# EAGLE schematic bms1818 (EAGLE 9.6.2)
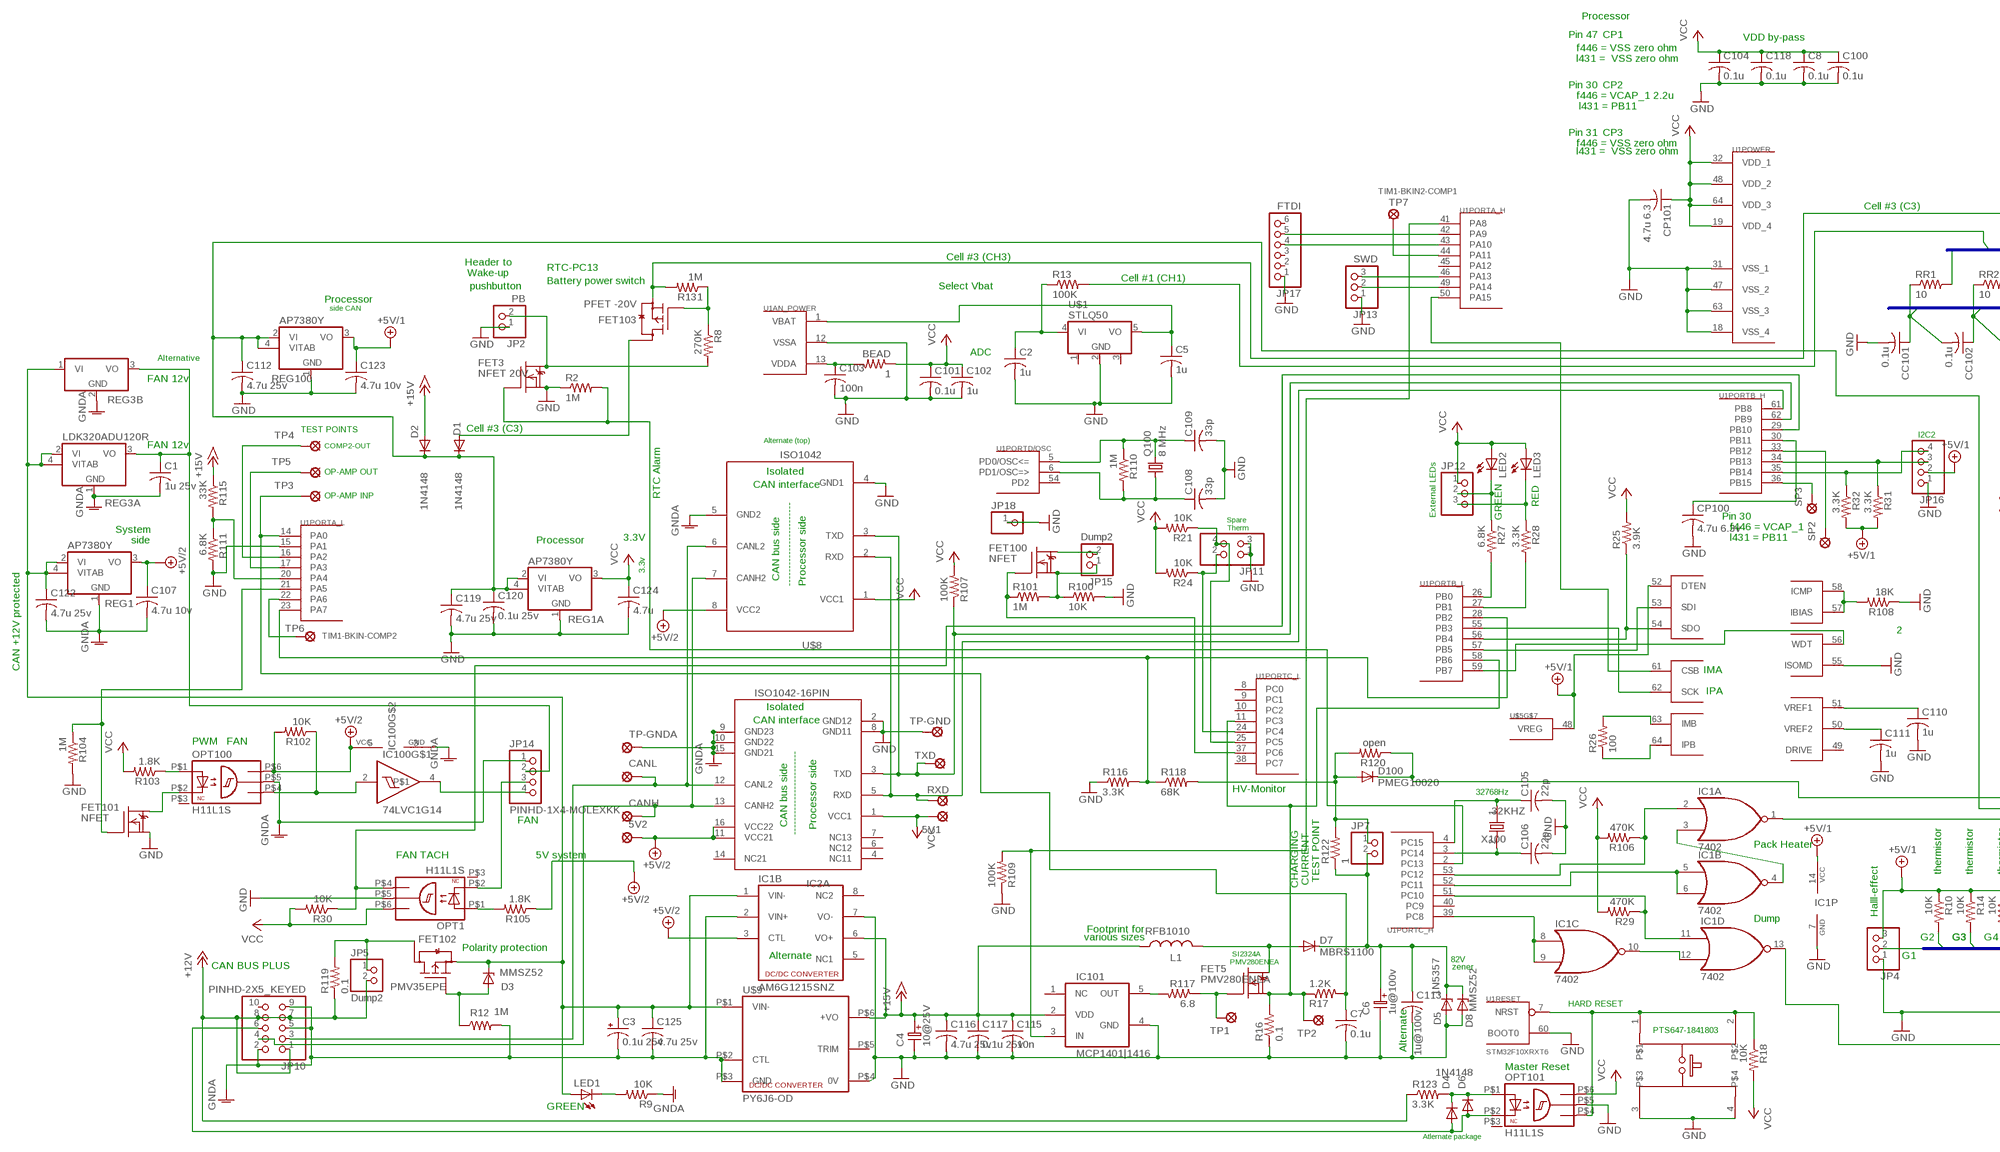
[diagram p0: schematic, sheet 1, part 1 of 2]
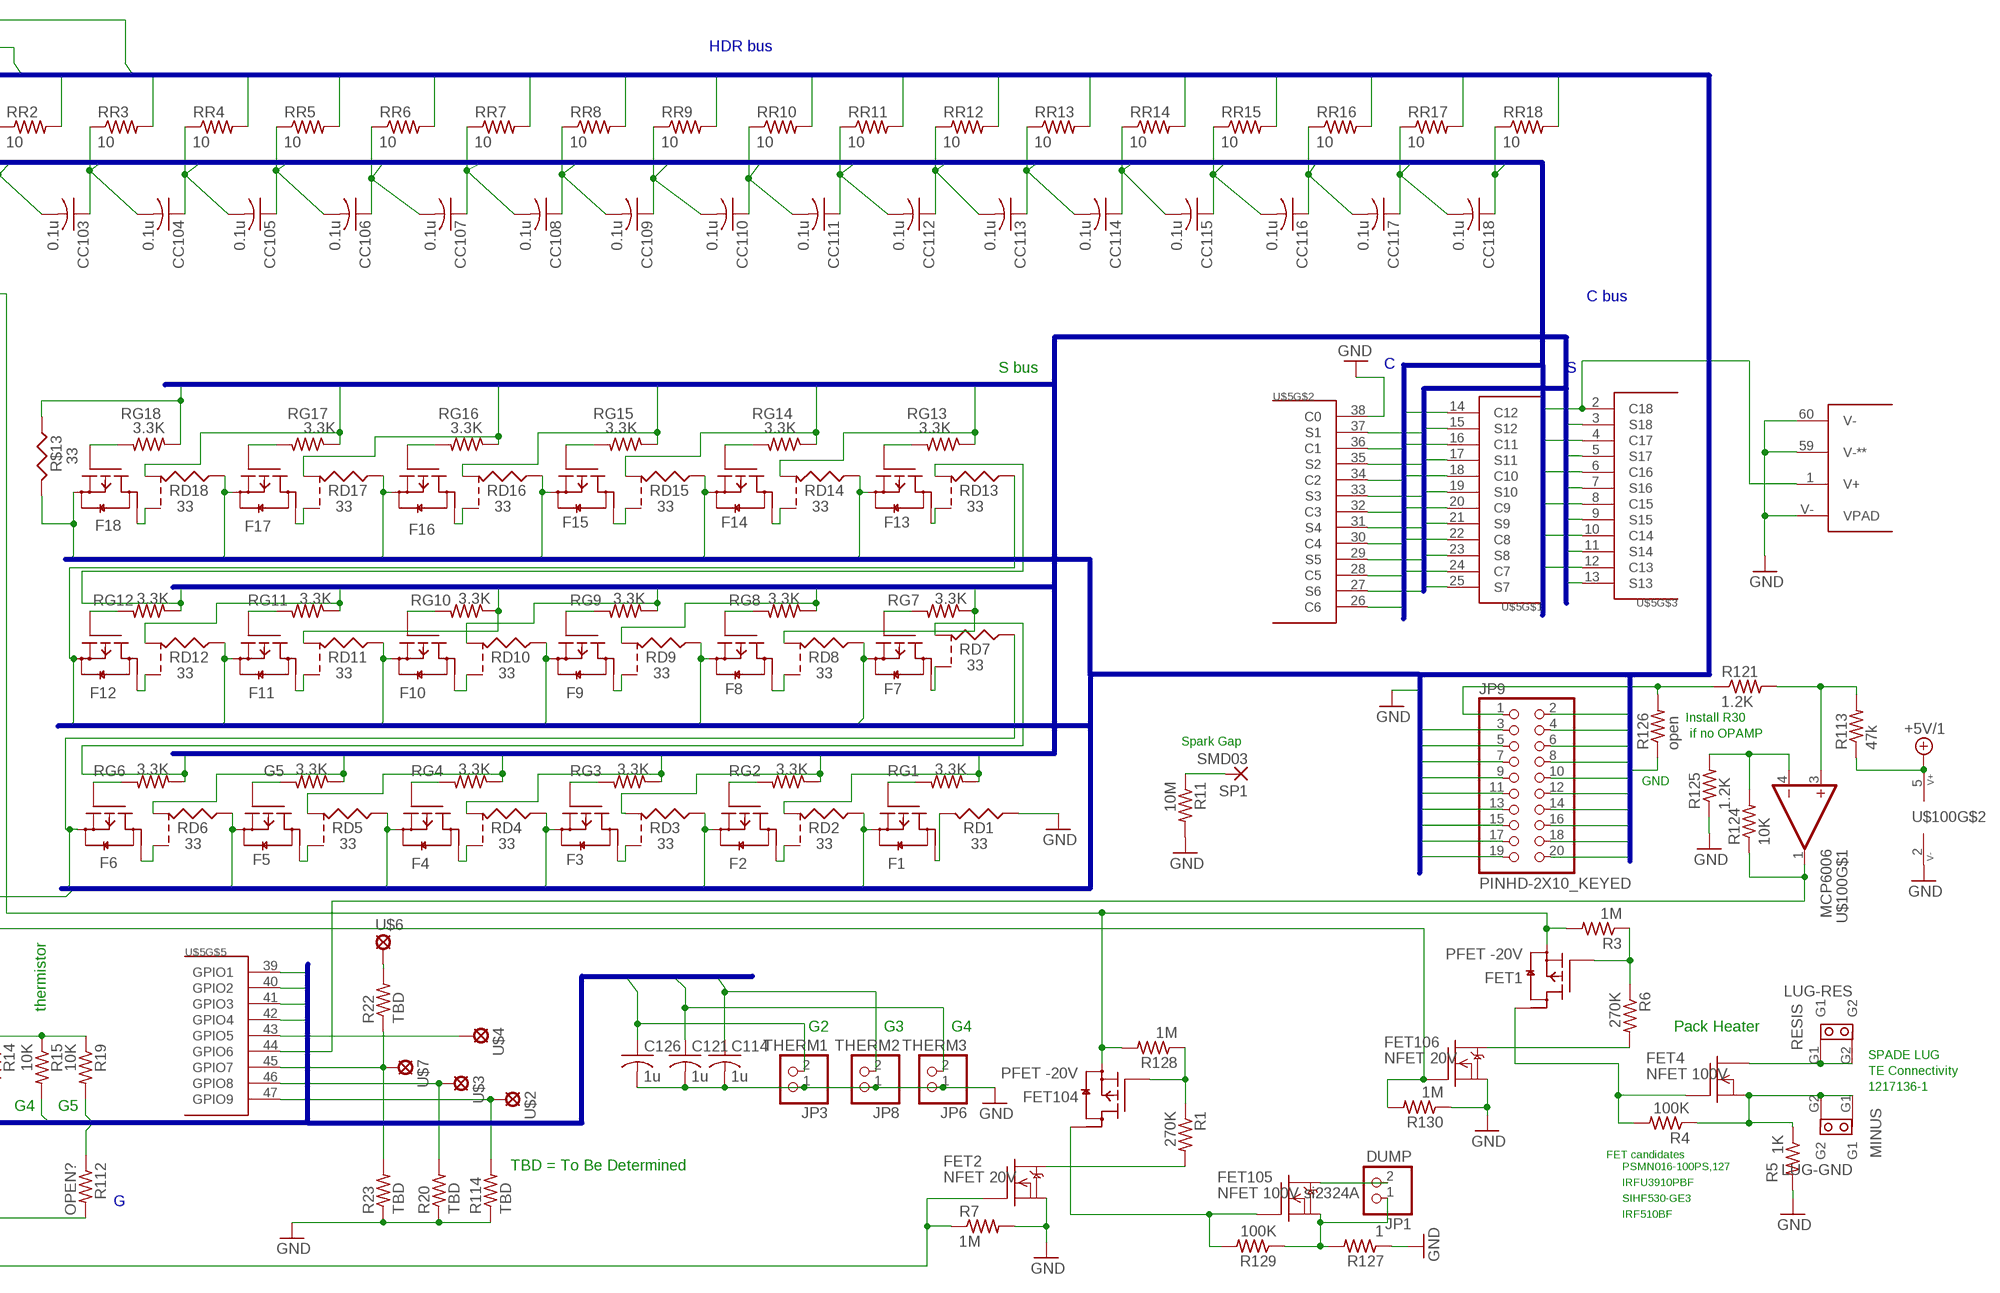
[diagram p1: schematic, sheet 1, part 2 of 2]

## Parts
5V1  SOLDPAD028  [SOLPAD028]
5V2  SOLDPAD028  [SOLPAD028]
32KHZ  X100  XTAL32KX32  [32KHZ]
BEAD  1  R-US_R0603  [R0603]
C1  1u 25v  C-USC0603  [C0603]
C2  1u  C-USC0603  [C0603]
C3  0.1u 25v  CPOL-USE5-8.5  [E5-8,5]
C4  10@25V  ELC-2,5L  [ES-2,5L]
C5  1u  C-USC0603  [C0603]
C6  1u@100v  ELC-2,5L  [ES-2,5L]
C7  0.1u  C-USC0603  [C0603]
C8  0.1u  C-USC0603  [C0603]
C100  0.1u  C-USC0603  [C0603]
C101  0.1u  C-USC0603  [C0603]
C102  1u  C-USC0603  [C0603]
C103  100n  C-USC0603  [C0603]
C104  0.1u  C-USC0603  [C0603]
C105  22p  C-USC0603  [C0603]
C106  22p  C-USC0603  [C0603]
C107  4.7u 10v  C-USC0603  [C0603]
C108  33p  C-USC0603  [C0603]
C109  33p  C-USC0603  [C0603]
C110  1u  C-USC0603  [C0603]
C111  1u  C-USC0603  [C0603]
C112  4.7u 25v  C-USC0805  [C0805]
C113  1u@100v  C-USC1206  [C1206]
C114  1u  C-USC0603  [C0603]
C115  10n  C-USC0603  [C0603]
C116  4.7u 25v  C-USC0805  [C0805]
C117  0.1u 25v  C-USC0603  [C0603]
C118  0.1u  C-USC0603  [C0603]
C119  4.7u 25v  C-USC0805  [C0805]
C120  0.1u 25v  C-USC0603  [C0603]
C121  1u  C-USC0603  [C0603]
C122  4.7u 25v  C-USC0805  [C0805]
C123  4.7u 10v  C-USC0603  [C0603]
C124  4.7u  C-USC0603  [C0603]
C125  4.7u 25v  C-USC0805  [C0805]
C126  1u  C-USC0603  [C0603]
CANH  SOLDPAD028  [SOLPAD028]
CANL  SOLDPAD028  [SOLPAD028]
CC101  0.1u  C-USC0603  [C0603]
CC102  0.1u  C-USC0603  [C0603]
CC103  0.1u  C-USC0603  [C0603]
CC104  0.1u  C-USC0603  [C0603]
CC105  0.1u  C-USC0603  [C0603]
CC106  0.1u  C-USC0603  [C0603]
CC107  0.1u  C-USC0603  [C0603]
CC108  0.1u  C-USC0603  [C0603]
CC109  0.1u  C-USC0603  [C0603]
CC110  0.1u  C-USC0603  [C0603]
CC111  0.1u  C-USC0603  [C0603]
CC112  0.1u  C-USC0603  [C0603]
CC113  0.1u  C-USC0603  [C0603]
CC114  0.1u  C-USC0603  [C0603]
CC115  0.1u  C-USC0603  [C0603]
CC116  0.1u  C-USC0603  [C0603]
CC117  0.1u  C-USC0603  [C0603]
CC118  0.1u  C-USC0603  [C0603]
CP100  4.7u 6.3v  C-USC0603  [C0603]
CP101  4.7u 6.3  C-USC0603  [C0603]
D1  1N4148  1N4004_VERT  [DO41-10_VERT]
D2  1N4148  1N4004_VERT  [DO41-10_VERT]
D3  MMSZ52  ZENER-DIODESOD80C  [SOD80C]
D4  DIODE-SOD323-R  [SOD323-R]
D5  1N5357  ZENER-5W-VERT  [ZENER-VERT]
D6  1N4148  DIODE-SOD123  [SOD123]
D7  MBRS1100  B100LB  [SMB_1]
D8  MMSZ52  ZENER-DIODESOD80C  [SOD80C]
D100  PMEG10020  PMEG10020PMEG10020-123W  [SOD123W]
F1  FET-P-SOT23  [SOT-23]
F2  FET-P-SOT23  [SOT-23]
F3  FET-P-SOT23  [SOT-23]
F4  FET-P-SOT23  [SOT-23]
F5  FET-P-SOT23  [SOT-23]
F6  FET-P-SOT23  [SOT-23]
F7  FET-P-SOT23  [SOT-23]
F8  FET-P-SOT23  [SOT-23]
F9  FET-P-SOT23  [SOT-23]
F10  FET-P-SOT23  [SOT-23]
F11  FET-P-SOT23  [SOT-23]
F12  FET-P-SOT23  [SOT-23]
F13  FET-P-SOT23  [SOT-23]
F14  FET-P-SOT23  [SOT-23]
F15  FET-P-SOT23  [SOT-23]
F16  FET-P-SOT23  [SOT-23]
F17  FET-P-SOT23  [SOT-23]
F18  FET-P-SOT23  [SOT-23]
FET1  PFET -20V  FET-P-SOT23  [SOT-23]
FET2  NFET 20V  DMN3404L  [SOT-23]
FET3  NFET 20V  DMN3404L  [SOT-23]
FET4  NFET 100V  RFP30N06  [TO220V]
FET5  PMV280ENEA  DMN3404L  [SOT-23]
FET100  NFET  DMN3404L  [SOT-23]
FET101  NFET  DMN3404L  [SOT-23]
FET102  PMV35EPE  FET-P-SOT23  [SOT-23]
FET103  PFET -20V  FET-P-SOT23  [SOT-23]
FET104  PFET -20V  FET-P-SOT23  [SOT-23]
FET105  NFET 100V si2324A  DMN3404L  [SOT-23]
FET106  NFET 20V  DMN3404L  [SOT-23]
G5  3.3K  R-US_R0603  [R0603]
IC1  7402  [TSSOP14]
IC1B  AM6G1215SNZ  [DCDC7PINB]
IC2A  ISO1042-16PIN  [SO-16DW]
IC100  74LVC1G14  74LVC1G17  [SOT-23]
IC101  MCP1401|1416  MCP1416  [SOT23-5]
JP1  DUMP  PINHD-1X2  [1X02]
JP2  PB  PINHD-1X2  [1X02]
JP3  THERM1  PINHD-1X2  [1X02]
JP4  PINHD-1X3  [1X03]
JP5  Dump2  PINHD-1X2  [1X02]
JP6  THERM3  PINHD-1X2  [1X02]
JP7  PINHD-1X2  [1X02]
JP8  THERM2  PINHD-1X2  [1X02]
JP9  PINHD-2X10_KEYED  [2X10_KEYED]
JP10  PINHD-2X5_KEYED  [2X05_KEYED]
JP11  PINHD-2X2  [2X02]
JP12  PINHD-1X3  [1X03]
JP13  SWD  PINHD-1X3  [1X03]
JP14  PINHD-1X4-MOLEXKK  [1X4-MOLEXKK]
JP15  Dump2  PINHD-1X2  [1X02]
JP16  PINHD-1X4  [1X04]
JP17  FTDI  PINHD-1X6  [1X06]
JP18  PINHD-1X1  [1X01]
L1  RFB1010  [INDUCTOR6.0]
LED1  LEDCHIP-LED0603  [CHIP-LED0603]
LED2  LEDCHIP-LED0603  [CHIP-LED0603]
LED3  LEDCHIP-LED0603  [CHIP-LED0603]
LUG-GND  MINUS  SPADE-TAB  [SPADE_TAB]
LUG-RES  RESIS  SPADE-TAB  [SPADE_TAB]
OPT1  H11L1S  H!!LX  [SMD-6]
OPT100  H11L1S  H!!LX  [SMD-6]
OPT101  H11L1S  H!!LX  [SMD-6]
Q100  8 MHz  CRYTALHC49S  [HC49/S]
R1  270K  R-US_R0603  [R0603]
R2  1M  R-US_R0603  [R0603]
R3  1M  R-US_R0603  [R0603]
R4  100K  R-US_R0603  [R0603]
R5  1K  R-US_R0603  [R0603]
R6  270K  R-US_R0603  [R0603]
R7  1M  R-US_R0603  [R0603]
R8  270K  R-US_R0603  [R0603]
R9  10K  R-US_R0603  [R0603]
R10  10K  R-US_R0603  [R0603]
R11  10M  R-US_R0603  [R0603]
R12  1M  R-US_R0603  [R0603]
R13  100K  R-US_R0603  [R0603]
R14  10K  R-US_R0603  [R0603]
R15  10K  R-US_R0603  [R0603]
R16  0.1  R-US_M1206  [M1206]
R17  1.2K  R-US_R0603  [R0603]
R18  10K  R-US_R0603  [R0603]
R19  10K  R-US_R0603  [R0603]
R20  TBD  R-US_R0603  [R0603]
R21  10K  R-US_R0603  [R0603]
R22  TBD  R-US_R0603  [R0603]
R23  TBD  R-US_R0603  [R0603]
R24  10K  R-US_R0603  [R0603]
R25  3.9K  R-US_R0603  [R0603]
R26  100  R-US_R0603  [R0603]
R27  6.8K  R-US_R0603  [R0603]
R28  3.3K  R-US_R0603  [R0603]
R29  470K  R-US_R0603  [R0603]
R30  10K  R-US_R0603  [R0603]
R31  3.3K  R-US_R0603  [R0603]
R32  3.3K  R-US_R0603  [R0603]
R100  10K  R-US_R0603  [R0603]
R101  1M  R-US_R0603  [R0603]
R102  10K  R-US_R0603  [R0603]
R103  1.8K  R-US_R0603  [R0603]
R104  1M  R-US_R0603  [R0603]
R105  1.8K  R-US_R0603  [R0603]
R106  470K  R-US_R0603  [R0603]
R107  100K  R-US_R0603  [R0603]
R108  18K  R-US_R0603  [R0603]
R109  100K  R-US_R0603  [R0603]
R110  1M  R-US_R0603  [R0603]
R111  6.8K  R-US_R0603  [R0603]
R112  OPEN?  R-US_R0603  [R0603]
R113  47k  R-US_R0603  [R0603]
R114  TBD  R-US_R0603  [R0603]
R115  33K  R-US_R0603  [R0603]
R116  3.3K  R-US_R0603  [R0603]
R117  6.8  R-US_R0603  [R0603]
R118  68K  R-US_R0603  [R0603]
R119  0.1  R-US_R0805  [R0805]
R120  open  R-US_R0603  [R0603]
R121  1.2K  R-US_R0603  [R0603]
R122  1  R-US_R0603  [R0603]
R123  3.3K  R-US_R0603  [R0603]
R124  10K  R-US_R0603  [R0603]
R125  1.2K  R-US_R0603  [R0603]
R126  open  R-US_R0603  [R0603]
R127  1  R-US_R0603  [R0603]
R128  1M  R-US_R0603  [R0603]
R129  100K  R-US_R0603  [R0603]
R130  1M  R-US_R0603  [R0603]
R131  1M  R-US_R0603  [R0603]
R$13  33  RESUS-S2,5  [RS-2,5]
RD1  33  RESUS-S2,5  [RS-2,5]
RD2  33  RESUS-S2,5-2  [RS-2,5-2]
RD3  33  RESUS-S2,5-2  [RS-2,5-2]
RD4  33  RESUS-S2,5-2  [RS-2,5-2]
RD5  33  RESUS-S2,5-2  [RS-2,5-2]
RD6  33  RESUS-S2,5-2  [RS-2,5-2]
RD7  33  RESUS-S2,5-2  [RS-2,5-2]
RD8  33  RESUS-S2,5-2  [RS-2,5-2]
RD9  33  RESUS-S2,5-2  [RS-2,5-2]
RD10  33  RESUS-S2,5-2  [RS-2,5-2]
RD11  33  RESUS-S2,5-2  [RS-2,5-2]
RD12  33  RESUS-S2,5-2  [RS-2,5-2]
RD13  33  RESUS-S2,5-2  [RS-2,5-2]
RD14  33  RESUS-S2,5-2  [RS-2,5-2]
RD15  33  RESUS-S2,5-2  [RS-2,5-2]
RD16  33  RESUS-S2,5-2  [RS-2,5-2]
RD17  33  RESUS-S2,5-2  [RS-2,5-2]
RD18  33  RESUS-S2,5-2  [RS-2,5-2]
REG1  AP7380Y  [SOT89]
REG1A  AP7380Y  [SOT89]
REG3A  LDK320ADU120R  AP7380Y  [SOT89]
REG3B  LM7812T  78  [TO220V]
REG100  AP7380Y  [SOT89]
RESET  RESET  E-SWITCH2  [E-SWITCH2]
RG1  3.3K  R-US_R0603  [R0603]
RG2  3.3K  R-US_R0603  [R0603]
RG3  3.3K  R-US_R0603  [R0603]
RG4  3.3K  R-US_R0603  [R0603]
RG6  3.3K  R-US_R0603  [R0603]
RG7  3.3K  R-US_R0603  [R0603]
RG8  3.3K  R-US_R0603  [R0603]
RG9  3.3K  R-US_R0603  [R0603]
RG10  3.3K  R-US_R0603  [R0603]
RG11  3.3K  R-US_R0603  [R0603]
RG12  3.3K  R-US_R0603  [R0603]
RG13  3.3K  R-US_R0603  [R0603]
RG14  3.3K  R-US_R0603  [R0603]
RG15  3.3K  R-US_R0603  [R0603]
RG16  3.3K  R-US_R0603  [R0603]
RG17  3.3K  R-US_R0603  [R0603]
RG18  3.3K  R-US_R0603  [R0603]
RR1  10  R-US_R0603  [R0603]
RR2  10  R-US_R0603  [R0603]
RR3  10  R-US_R0603  [R0603]
RR4  10  R-US_R0603  [R0603]
RR5  10  R-US_R0603  [R0603]
RR6  10  R-US_R0603  [R0603]
RR7  10  R-US_R0603  [R0603]
RR8  10  R-US_R0603  [R0603]
RR9  10  R-US_R0603  [R0603]
RR10  10  R-US_R0603  [R0603]
RR11  10  R-US_R0603  [R0603]
RR12  10  R-US_R0603  [R0603]
RR13  10  R-US_R0603  [R0603]
RR14  10  R-US_R0603  [R0603]
RR15  10  R-US_R0603  [R0603]
RR16  10  R-US_R0603  [R0603]
RR17  10  R-US_R0603  [R0603]
RR18  10  R-US_R0603  [R0603]
RXD  SOLDPAD028  [SOLPAD028]
SP1  SMD03  [SMD03]
SP2  SOLDPAD028  [SOLPAD028]
SP3  SOLDPAD028  [SOLPAD028]
TP1  SOLDPAD028  [SOLPAD028]
TP2  SOLDPAD028  [SOLPAD028]
TP3  SOLDPAD0.6MM  [SOLPAD.6MM]
TP4  SOLDPAD0.6MM  [SOLPAD.6MM]
TP5  SOLDPAD0.6MM  [SOLPAD.6MM]
TP6  SOLDPAD0.6MM  [SOLPAD.6MM]
TP7  SOLDPAD0.6MM  [SOLPAD.6MM]
TP-GND  SOLDPAD028  [SOLPAD028]
TP-GNDA  SOLDPAD028  [SOLPAD028]
TXD  SOLDPAD028  [SOLPAD028]
U1  STM32F10XRXT6  [TQFP64]
U$1  STLQ50  [SOT-323-5]
U$2  SOLDPAD028  [SOLPAD028]
U$3  SOLDPAD028  [SOLPAD028]
U$4  SOLDPAD028  [SOLPAD028]
U$5  LTC6813  [TQFP64_PAD]
U$6  SOLDPAD028  [SOLPAD028]
U$7  SOLDPAD028  [SOLPAD028]
U$8  ISO1042  [SOIC-8]
U$9  PY6J6-OD  [PYJ6-OD]
U$100  MCP6006  [SC-70-5]

## Nets
12V-R: FET102.3(D) JP5.1 R119.2
+5V/1: C123.1 IC1.14(P:VCC) JP4.3 JP16.2 R10.1 R14.1 R15.1 R19.1 R31.2 R32.2 R113.1 REG100.3(VO) U$5.48(VREG) U$5.52(DTEN) U$100.5(V+)
+5V/2: 5V2.MP C107.1 IC1B.3(CTL) IC2A.11(VCC21) IC2A.16(VCC22) IC100.5(VCC) OPT100.P$6(VCC) R102.2 R105.1 REG1.3(VO) U$8.8(VCC2)
+12V: JP5.2 JP10.1 JP10.7 JP10.8 R119.1 R123.1
+15V: C4.1 C115.1 C116.1 C117.1 D2.A IC1B.6(VO+) IC101.2(VDD) L1.1 R115.1 U$9.P$6(+VO)
/PC10: IC1.3(A:I1) IC1.4(B:O)
BATSW-NDRAIN: FET3.3(D) JP2.2 R8.2
BATSW-NDRAIN1: FET2.3(D) R1.2
BATSW-NDRAIN2: FET106.3(D) R6.2
BATSW-PGATE: FET103.1(G) R8.1 R131.1
BATSW-PGATE1: FET104.1(G) R1.1 R128.1
BATSW-PGATE2: FET1.1(G) R3.1 R6.1
BIGFET-DRAIN: FET4.2(D) LUG-RES.G1 LUG-RES.G2
BIGFET-GATE: FET1.3(D) FET4.1(G) R4.2
BIGFET-SOURCE: FET4.3(S) LUG-GND.G1 LUG-GND.G2 R4.1 R5.1
C1: CC101.1 CC102.2 RR1.1 U$5.36(C1)
C2: CC102.1 CC103.2 RR2.1 U$5.34(C2)
C3: CC103.1 CC104.2 RR3.1 U$5.32(C3)
C4: CC104.1 CC105.2 RR4.1 U$5.30(C4)
C5: CC105.1 CC106.2 RR5.1 U$5.28(C5)
C6: CC106.1 CC107.2 RR6.1 U$5.26(C6)
C7: CC107.1 CC108.2 RR7.1 U$5.24(C7)
C8: CC108.1 CC109.2 RR8.1 U$5.22(C8)
C9: CC109.1 CC110.2 RR9.1 U$5.20(C9)
C10: CC110.1 CC111.2 RR10.1 U$5.18(C10)
C11: CC111.1 CC112.2 RR11.1 U$5.16(C11)
C12: CC112.1 CC113.2 RR12.1 U$5.14(C12)
C13: CC113.1 CC114.2 RR13.1 U$5.12(C13)
C14: CC114.1 CC115.2 RR14.1 U$5.10(C14)
C15: CC115.1 CC116.2 RR15.1 U$5.8(C15)
C16: CC116.1 CC117.2 RR16.1 U$5.6(C16)
C17: CC117.1 CC118.2 RR17.1 U$5.4(C17)
C18: CC118.1 RR18.1 U$5.1(V+) U$5.2(C18)
CAN+12PRO: C3.+ C122.1 C125.1 D3.C FET102.2(S) IC1B.1(VIN-) LED1.A REG1.2(VI) REG1.4(VITAB) REG3A.2(VI) REG3A.4(VITAB) REG3B.1(VI) U$9.P$1(VIN-)
CANH2: CANH.MP IC2A.13(CANH2) JP10.4 U$8.7(CANH2)
CANL2: CANL.MP IC2A.12(CANL2) JP10.3 U$8.6(CANL2)
CELL1-PFET-DRAIN: D1.A FET103.3(D)
CH1: F1.2(S) JP9.12 R13.2 RD2.1 RR1.2
CH2: F2.2(S) JP9.3 RD3.1 RR2.2
CH3: F3.2(S) FET103.2(S) JP9.13 R131.2 RD4.1 RR3.2
CH4: F4.2(S) JP9.4 RD5.1 RR4.2
CH5: F5.2(S) JP9.14 RD6.1 RR5.2
CH6: F6.2(S) JP9.5 RD7.1 RR6.2
CH7: F7.2(S) JP9.15 RD8.1 RR7.2
CH8: F8.2(S) JP9.6 RD9.1 RR8.2
CH9: F9.2(S) JP9.16 RD10.1 RR9.2
CH10: F10.2(S) JP9.7 RD11.1 RR10.2
CH11: F11.2(S) JP9.17 RD12.1 RR11.2
CH12: F12.2(S) JP9.8 RD13.1 RR12.2
CH13: F13.2(S) JP9.18 RD14.1 RR13.2
CH14: F14.2(S) JP9.9 RD15.1 RR14.2
CH15: F15.2(S) JP9.19 RD16.1 RR15.2
CH16: F16.2(S) JP9.10 RD17.1 RR16.2
CH17: F17.2(S) JP9.20 RD18.1 RR17.2
CH18: D100.A(C) F18.2(S) JP9.11 R120.1 R$13.2 RR18.2
CHGR-FET-DRAIN: D7.A FET5.3(D) L1.2
CHGR-TEST-V+: D100.C(A) JP7.1 R118.2 R120.2 R122.2
CHGR-V+: C6.1 C113.1 D5.2(C) D7.C D8.C JP7.2 R122.1
DRAIN$1: F1.3(D) RD1.2
DRAIN$2: F2.3(D) RD2.3
DRAIN$3: F3.3(D) RD3.3
DRAIN$4: F4.3(D) RD4.3
DRAIN$5: F5.3(D) RD5.3
DRAIN$6: F6.3(D) RD6.3
DRAIN$7: F7.3(D) RD7.3
DRAIN$8: F8.3(D) RD8.3
DRAIN$9: F9.3(D) RD9.3
DRAIN$10: F10.3(D) RD10.3
DRAIN$11: F11.3(D) RD11.3
DRAIN$12: F12.3(D) RD12.3
DRAIN$13: F13.3(D) RD13.3
DRAIN$14: F14.3(D) RD14.3
DRAIN$15: F15.3(D) RD15.3
DRAIN$16: F16.3(D) RD16.3
DRAIN$17: F17.3(D) RD17.3
DRAIN$18: F18.3(D) RD18.3
DUMP2: FET100.3(D) JP15.2
DUMP2FET-SOURCE: FET100.2(S) JP15.1 R100.1 R101.2
DUMPFET-DRAIN: FET105.3(D) JP1.2
DUMPFET-GATE: FET104.3(D) FET105.1(G) R129.2
DUMPFET-SOURCE: FET105.2(S) JP1.1 R127.2 R129.1
FAN+12: C1.1 JP14.2 REG3A.3(VO) REG3B.3(VO)
FANPWN: IC100.2(I) OPT100.P$4(OUT) R102.1
FANPWN-INVERT: IC100.4 JP14.4
FANTACH-H11DIODE: JP14.3 OPT1.P$2(C)
FANTACH-RESISTOR: OPT1.P$1(A) R105.2
FET103-GATE: D3.A FET102.1(G) R12.1
G1: JP4.2 U$5.39(GPIO1)
G2: C126.1 JP3.2 R10.2 U$5.40(GPIO2)
G3: C121.1 JP6.2 R14.2 U$5.41(GPIO3)
G4: C114.1 JP8.2 R15.2 U$5.42(GPIO4)
G5: R19.2 R112.1 U$4.MP U$5.43(GPIO5)
G6: R124.1 U$5.44(GPIO6) U$100.1(OUT)
G7: R22.1 R23.2 U$5.45(GPIO7) U$7.MP
G7-DIVIDER-HIGH: R22.2 U$6.MP
G8: R20.2 U$3.MP U$5.46(GPIO8)
G9: R114.2 U$2.MP U$5.47(GPIO9)
GATE-DRV-MCP1416: IC101.5(OUT) R117.2
GHR_FET_GATE: FET5.1(G) R117.1 TP1.MP
GND: C2.2 C4.2 C5.2 C6.2 C7.2 C8.2 C100.2 C101.2 C102.2 C103.2 C104.2 C105.2 C106.2 C108.2 C109.2 C110.2 C111.2 C112.2 C113.2 C114.2 C115.2 C116.2 C117.2 C118.2 C119.2 C120.2 C121.2 C123.2 C124.2 C126.2 CC101.2 CP100.2 CP101.2 D5.1(A) D8.A FET2.2(S) FET3.2(S) FET101.2(S) FET106.2(S) IC1.7(P:GND) IC1B.7(VO-) IC2A.2(GND12) IC2A.8(GND11) IC101.4(GND) JP2.1 JP3.1 JP4.1 JP6.1 JP8.1 JP9.2 JP11.1 JP11.3 JP13.1 JP16.1 JP17.1 JP18.1 OPT1.P$5(GND) OPT101.P$5(GND) R2.1 R5.2 R7.2 R11.2 R16.1 R20.1 R23.1 R100.2 R104.2 R108.1 R109.1 R111.2 R112.2 R114.1 R116.1 R125.1 R126.1 R127.1 R130.1 RD1.1 REG1A.1(GND) REG100.1(GND) RESET.3 RESET.4 TP-GND.MP U1.12(AN_POWER:VSSA) U1.15(PORTA_L:PA1) U1.18(POWER:VSS_4) U1.31(POWER:VSS_1) U1.47(POWER:VSS_2) U1.60(RESET:BOOT0) U1.63(POWER:VSS_3) U$1.2(GND) U$5.38(C0) U$5.55(ISOMD) U$5.59(V-**) U$5.60(V-) U$5.V-(VPAD) U$8.4(GND1) U$9.P$4(0V) U$100.2(V-)
GNDA: C1.2 C3.- C107.2 C122.2 C125.2 IC1B.2(VIN+) IC2A.9(GND23) IC2A.10(GND22) IC2A.15(GND21) IC100.3(GND) JP10.2 JP10.5 JP10.9 JP14.1 OPT100.P$5(GND) R9.1 R12.2 REG1.1(GND) REG3A.1(GND) REG3B.2(GND) TP-GNDA.MP U$8.5(GND2) U$9.P$2(CTL) U$9.P$3(GND)
GT1: F1.1(G) RG1.2
GT2: F2.1(G) RG2.2
GT3: F3.1(G) RG3.2
GT4: F4.1(G) RG4.2
GT5: F5.1(G) G5.2
GT6: F6.1(G) RG6.2
GT7: F7.1(G) RG7.2
GT8: F8.1(G) RG8.2
GT9: F9.1(G) RG9.2
GT10: F10.1(G) RG10.2
GT11: F11.1(G) RG11.2
GT12: F12.1(G) RG12.2
GT13: F13.1(G) RG13.2
GT14: F14.1(G) RG14.2
GT15: F15.1(G) RG15.2
GT16: F16.1(G) RG16.2
GT17: F17.1(G) RG17.2
GT18: F18.1(G) RG18.2
H11L-PWM-R: OPT100.P$1(A) R103.1
H11PWM-FETDRV: FET101.3(D) OPT100.P$2(C)
ICMP-IBIAS: R108.2 U$5.57(IBIAS) U$5.58(ICMP)
IMB: R26.2 U$5.63(IMB)
IPB: R26.1 U$5.64(IPB)
K1: R11.1 SP1.1(P)
LED-EXT-GRN-CATHODE: JP12.2 LED2.C R27.1
LED-EXT-RED-CATHODE: JP12.3 LED3.C R28.1
LED_BUS_PWR: LED1.C R9.2
MASTER-RESET-RESISTOR: D4.C D6.C OPT101.P$1(A) R123.2
MASTER-RESET-SYS: D4.A D6.A JP10.6 OPT101.P$2(C)
N$2: JP9.1 R121.1 R126.2
NRST: OPT101.P$4(OUT) R18.1 RESET.1 RESET.2 U1.7(RESET:NRST)
OPA-VIN+: R113.2 R121.2 U$100.3(+IN)
OPA-VIN-: R124.2 R125.2 U$100.4(-IN)
PA0-OP-FILTERCURRENT: C7.1 R17.2 TP3.MP U1.14(PORTA_L:PA0)
PA2-COMP2-OUT: TP4.MP U1.16(PORTA_L:PA2)
PA3-OPAMP_INP: TP5.MP U1.17(PORTA_L:PA3)
PA4-15V-OR-DIVIDED-IN4: R111.1 R115.2 U1.20(PORTA_L:PA4)
PA5-FETGATE-FAN-PWM: FET101.1(G) R104.1 U1.21(PORTA_L:PA5)
PA6-T1-BKIN-COMP2: TP6.MP U1.22(PORTA_L:PA6)
PA8-T1C1-MCP1416_DRV: IC101.3(IN) R109.2 U1.41(PORTA_H:PA8)
PA9-USART1-TX: JP17.5 U1.42(PORTA_H:PA9)
PA10-USART1-RX: JP17.4 U1.43(PORTA_H:PA10)
PA13-SWDIO: JP13.3 U1.46(PORTA_H:PA13)
PA14-SWCLK: JP13.2 U1.49(PORTA_H:PA14)
PA15-SP1_NSS-CSB: U1.50(PORTA_H:PA15) U$5.61(CSB)
PB0-LED-GRN: R27.2 U1.26(PORTB_L:PB0)
PB1-LED-RED: R28.2 U1.27(PORTB_L:PB1)
PB2-PA7-HV-DIV-COMP1_INP: R116.2 R118.1 U1.23(PORTA_L:PA7) U1.28(PORTB_L:PB2)
PB3-SPI1_SCK-SCK: U1.55(PORTB_L:PB3) U$5.62(SCK)
PB4-SP1_MISO-SDO: R25.1 U1.56(PORTB_L:PB4) U$5.54(SDO)
PB5-SPI1_MOSI-SDI: U1.57(PORTB_L:PB5) U$5.53(SDI)
PB6-PC3-COMP2_INP-CURRENT-SENSE: FET5.2(S) R16.2 R17.1 TP2.MP U1.11(PORTC_L:PC3) U1.58(PORTB_L:PB6)
PB7|WDT: U1.59(PORTB_L:PB7) U$5.56(WDT)
PB8-CAN-RX: IC2A.5(RXD) RXD.MP U1.61(PORTB_H:PB8) U$8.2(RXD)
PB9-CAN-TX: IC2A.3(TXD) R107.1 TXD.MP U1.62(PORTB_H:PB9) U$8.3(TXD)
PB10-T2C3-FANTACH-H11L1OUT: OPT1.P$4(OUT) R30.1 U1.29(PORTB_H:PB10)
PB11-I2C2-SDA|VCAP1: CP100.1 U1.30(PORTB_H:PB11)
PB12-SPI2-NSS: SP2.MP U1.33(PORTB_H:PB12)
PB14-I2C2-SDA: JP16.4 R32.1 U1.35(PORTB_H:PB14)
PB-13-I2C2-SCK: JP16.3 R31.1 U1.34(PORTB_H:PB13)
PB-15: SP3.MP U1.36(PORTB_H:PB15)
PC4: JP11.2 R24.1 U1.24(PORTC_L:PC4)
PC5: JP11.4 R21.1 U1.25(PORTC_L:PC5)
PC6-DUMPFET-GATE: FET100.1(G) R101.1 U1.37(PORTC_L:PC6)
PC8-/DUMP: IC1.8(C:I0) IC1.9(C:I1) U1.39(PORTC_H:PC8)
PC8-DUMP: IC1.10(C:O) IC1.12(D:I1)
PC10&/PC8-DUMP-FET-GATE: FET2.1(G) IC1.13(D:O) R7.1
PC10-DUMP: IC1.11(D:I0) R29.1 U1.51(PORTC_H:PC10)
PC11-/HEATER: IC1.5(B:I0) IC1.6(B:I1) U1.52(PORTC_H:PC11)
PC12-HEATER: IC1.2(A:I0) R106.1 U1.53(PORTC_H:PC12)
PC13-RTC-OUT: FET3.1(G) R2.2 U1.2(PORTC_H:PC13)
PC14_OSC32IN|XTAL: 32KHZ.2 C106.1 U1.3(PORTC_H:PC14)
PC15-32OSC-OUT: 32KHZ.1 C105.1 U1.4(PORTC_H:PC15)
PD0_OSC_IN_XTAL: C109.1 Q100.2 R110.1 U1.5(PORTD/OSC:PD0/OSC<=)
PD1_OSC_OUT: C108.1 Q100.1 R110.2 U1.6(PORTD/OSC:PD1/OSC=>)
S1: RD2.2 RG1.1 U$5.37(S1)
S2: RD3.2 RG2.1 U$5.35(S2)
S3: RD4.2 RG3.1 U$5.33(S3)
S4: RD5.2 RG4.1 U$5.31(S4)
S5: G5.1 RD6.2 U$5.29(S5)
S6: RD7.2 RG6.1 U$5.27(S6)
S7: RD8.2 RG7.1 U$5.25(S7)
S8: RD9.2 RG8.1 U$5.23(S8)
S9: RD10.2 RG9.1 U$5.21(S9)
S10: RD11.2 RG10.1 U$5.19(S10)
S11: RD12.2 RG11.1 U$5.17(S11)
S12: RD13.2 RG12.1 U$5.15(S12)
S13: RD14.2 RG13.1 U$5.13(S13)
S14: RD15.2 RG14.1 U$5.11(S14)
S15: RD16.2 RG15.1 U$5.9(S15)
S16: RD17.2 RG16.1 U$5.7(S16)
S17: RD18.2 RG17.1 U$5.5(S17)
S18: R$13.1 RG18.1 U$5.3(S18)
TIM1_BKIN2_COMP2: TP7.MP U1.44(PORTA_H:PA11)
V-ORED: C112.1 C119.1 C120.1 D1.C D2.C FET1.2(S) FET104.2(S) R3.2 R128.2 REG1A.2(VI) REG1A.4(VITAB) REG100.2(VI) REG100.4(VITAB)
VBAT-REG-IN: C2.1 R13.1 U$1.4(VI)
VBAT-REG-OUT: C5.1 U1.1(AN_POWER:VBAT) U$1.5(VO)
VCC: 5V1.MP BEAD.1 C8.1 C100.1 C101.1 C102.1 C104.1 C118.1 C124.1 CP101.1 IC2A.1(VCC1) JP12.1 LED2.A LED3.A OPT1.P$6(VCC) OPT101.P$6(VCC) R18.2 R21.2 R24.2 R25.2 R29.2 R30.2 R103.2 R106.2 R107.2 REG1A.3(VO) U1.19(POWER:VDD_4) U1.32(POWER:VDD_1) U1.48(POWER:VDD_2) U1.64(POWER:VDD_3) U$8.1(VCC1)
VDDA1: BEAD.2 C103.1 U1.13(AN_POWER:VDDA)
VREF3: C110.1 U$5.51(VREF1)
VREF4: C111.1 U$5.50(VREF2)
XOR-BIGFET-GATE: FET106.1(G) IC1.1(A:O) R130.2
Unconnected: IC1B.5(NC1) IC1B.8(NC2) IC2A.4(NC11) IC2A.6(NC12) IC2A.7(NC13) IC2A.14(NC21) IC101.1(NC) JP10.10 JP17.2 JP17.3 JP17.6 OPT1.P$3(NC) OPT100.P$3(NC) OPT101.P$3(NC) U1.8(PORTC_L:PC0) U1.9(PORTC_L:PC1) U1.10(PORTC_L:PC2) U1.38(PORTC_L:PC7) U1.40(PORTC_H:PC9) U1.45(PORTA_H:PA12) U1.54(PORTD/OSC:PD2) U$1.1(NC1) U$1.3(NC2) U$5.49(DRIVE) U$9.P$5(TRIM)

## Buses
HDR$:GND,CH[0..18]
G[1..9]
C[0..18]
S[1..18]

## Notes on the sheet
- Processor
- Pin 47 | CP1 | VDD by-pass
- f446 = VSS zero ohm
- l431 =  VSS zero ohm
- Pin 30 | CP2
- f446 = VCAP_1 2.2u
- l431 = PB11
- Pin 31 | CP3
- f446 = VSS zero ohm
- l431 =  VSS zero ohm
- TIM1-BKIN2-COMP1
- Cell #3 (C3)
- HDR bus
- V-ORED | 9-15v
- Cell #3 (CH3)
- Header to
- RTC-PC13
- Wake-up
- Battery power | switch | Cell #1 (CH1)
- pushbutton | Select Vbat
- Processor
- side CAN
- ADC
- Alternative
- FAN 12v
- C bus
- Cell #3 (C3)
- TEST POINTS
- I2C2
- ~12v | Alternate (top) | C
- FAN 12v | COMP2-OUT | S bus | S
- OP-AMP OUT | Isolated
- CAN interface
- OP-AMP INP | RTC Alarm
- RED
- External LEDs
- GREEN | Pin 30
- Spare
- Therm | f446 = VCAP_1
- System
- side | Processor | 3.3V | l431 = PB11
- 3.3v
- CAN bus side
- ------------------------ | Processor side
- 2
- TIM1-BKIN-COMP2
- CAN +12V protected | IMA
- Install R30
- if no OPAMP
- IPA
- Spark Gap
- Isolated
- CAN interface | GND
- PWM | FAN
- HV-Monitor
- 32768Hz
- V-ORED | 9-15v
- FAN
- CAN bus side | Processor side
- ------------------------
- Pack Heater
- FAN | TACH | 5V system
- thermistor | thermistor | thermistor
- CURRENT | TEST POINT
- CHARGING | G2 | G3 | G4 | Pack Heater
- SPADE LUG
- Halll-effect | TE Connectivity
- Dump
- 1217136-1
- Footprint for
- various sizes | G2 | G3 | G3 | G4 | G5
- Polarity protection
- SI2324A | 82V
- CAN BUS PLUS | Alternate | G1
- PMV280ENEA
- zener
- FET candidates
- TBD = To Be Determined | PSMN016-100PS,127
- IRFU3910PBF
- SIHF530-GE3
- G
- HARD | RESET
- IRF510BF
- PTS647-1841803
- Alternate
- Master Reset
- GREEN
- Atlernate package

## Library data of the parts
5V1 5V2 CANH CANL RXD SP2 SP3 TP1 TP2 TP-GND TP-GNDA TXD U$2-U$4 U$6 U$7 = solpad:SOLDPAD028
32KHZ = crystal:XTAL32K
BEAD G5 R1-R32 R100-R131 RG1-RG4 RG6-RG18 RR1-RR18 = rcl:R-US_: RESISTOR, American symbol
C1 C2 C5 C7 C8 C100-C126 CC101-CC118 CP100 CP101 = rcl:C-US: CAPACITOR, American symbol
C3 = rcl:CPOL-US: POLARIZED CAPACITOR, American symbol
C4 C6 = DEH:ELC-2,5L
D1 D2 = diode:1N4004_VERT
D3 D8 = diode-1:ZENER-DIODE: Z-Diode
D4 D6 = diode:DIODE-: DIODE
D5 = DEH:ZENER-5W-VERT
D7 = diode-1:B100LB
D100 = diode-1:PMEG10020
F1-F18 FET1 FET102-FET104 = transistor-fet:FET-P-SOT23
FET2 FET3 FET5 FET100 FET101 FET105 FET106 = transistor-fet:DMN3404L
FET4 = transistor-fet:RFP30N06
IC1 = 74xx-us:74*02: Quad 2-input NOR gate
IC1B = dc-dc-converter:AM6G1215SNZ
IC2A = texas:ISO1042-16PIN
IC100 = 74xx-us:74LVC1G17
IC101 = DEH:MCP1416
JP1-JP3 JP5-JP8 JP15 = pinhead:PINHD-1X2: PIN HEADER
JP4 JP12 JP13 = pinhead:PINHD-1X3: PIN HEADER
JP9 = pinhead:PINHD-2X10_KEYED
JP10 = pinhead:PINHD-2X5_KEYED
JP11 = pinhead:PINHD-2X2: PIN HEADER
JP14 = pinhead:PINHD-1X4-MOLEXKK
JP16 = pinhead:PINHD-1X4: PIN HEADER
JP17 = pinhead:PINHD-1X6: PIN HEADER
JP18 = pinhead:PINHD-1X1: PIN HEADER
L1 = DEH:RFB1010
LED1-LED3 = led:LED: LED OSRAM: - CHIPLED LG R971, LG N971, LY N971, LG Q971, LY Q971, LO R971, LY R971 LH N974, LH R974 LS Q976, LO Q976, LY Q976 LO Q996 - Hyper CHIPLED LW Q18S LB Q993, LB Q99A, LB R99A - SideLED LS A670, LO A670, LY A670, LG A670, LP A670 LB A673, LV A673, LT A673, LW A673 LH A674 LY A675 LS A676, LA A676, LO A676, LY A676, LW A676 LS A679, LY A679, LG A679 - Hyper Micro SIDELED® LS Y876, LA Y876, LO Y876, LY Y876 LT Y87S - SmartLED LW L88C, LW L88S LB L89C, LB L89S, LG L890 LS L89K, LO L89K, LY L89K LS L896, LA L896, LO L896, LY L896 - TOPLED LS T670, LO T670, LY T670, LG T670, LP T670 LSG T670, LSP T670, LSY T670, LOP T670, LYG T670 LG T671, LOG T671, LSG T671 LB T673, LV T673, LT T673, LW T673 LH T674 LS T676, LA T676, LO T676, LY T676, LB T676, LH T676, LSB T676, LW T676 LB T67C, LV T67C, LT T67C, LS T67K, LO T67K, LY T67K, LW E67C LS E67B, LA E67B, LO E67B, LY E67B, LB E67C, LV E67C, LT E67C LW T67C LS T679, LY T679, LG T679 LS T770, LO T770, LY T770, LG T770, LP T770 LB T773, LV T773, LT T773, LW T773 LH T774 LS E675, LA E675, LY E675, LS T675 LS T776, LA T776, LO T776, LY T776, LB T776 LHGB T686 LT T68C, LB T68C - Hyper Mini TOPLED® LB M676 - Mini TOPLED Santana® LG M470 LS M47K, LO M47K, LY M47K Source: http://www.osram.convergy.de/
LUG-GND LUG-RES = DEH:SPADE-TAB
OPT1 OPT100 OPT101 = optocoupler:H!!LX
Q100 = crystal:CRYTAL: CRYSTAL
R$13 RD1 = DEH:RESUS-S2,5
RD2-RD18 = DEH:RESUS-S2,5-2
REG1 REG1A REG3A REG100 = linear:AP7380Y
REG3B = linear:78*: Positive VOLTAGE REGULATOR
RESET = switch-misc:E-SWITCH2
SP1 = wirepad:SMD03
TP3-TP7 = solpad:SOLDPAD0.6MM
U1 = stm32:STM32F10XRXT6: STM32F101/103 64pin LQFP
U$1 = linear:STLQ50
U$5 = stm32:LTC6813
U$8 = texas:ISO1042
U$9 = dc-dc-converter:PY6J6-OD
U$100 = op-amp:MCP6006